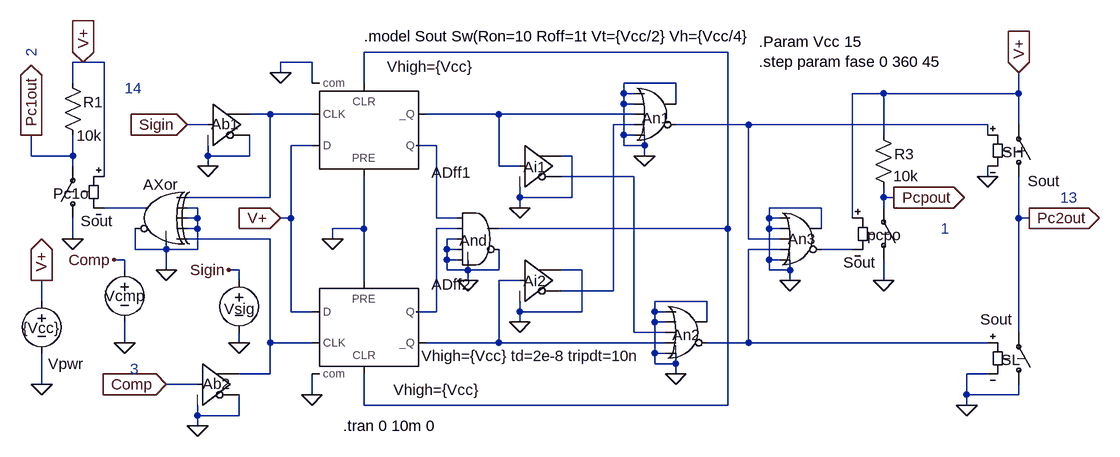
[diagram p0: schematic DF2b.asc]
DF2b.asc, the LTspice schematic file:
Version 4
SHEET 1 1280 856
WIRE -672 240 -672 208
WIRE -656 464 -656 432
WIRE -656 592 -656 544
WIRE -608 128 -608 96
WIRE -608 240 -672 240
WIRE -608 240 -608 208
WIRE -608 256 -608 240
WIRE -608 368 -608 336
WIRE -592 96 -608 96
WIRE -560 96 -592 96
WIRE -560 272 -560 96
WIRE -528 400 -544 400
WIRE -528 416 -528 400
WIRE -528 528 -528 496
WIRE -512 384 -512 352
WIRE -496 320 -560 320
WIRE -464 384 -512 384
WIRE -464 384 -464 368
WIRE -464 416 -464 384
WIRE -416 320 -432 320
WIRE -416 336 -432 336
WIRE -416 336 -416 320
WIRE -416 352 -432 352
WIRE -416 352 -416 336
WIRE -416 384 -464 384
WIRE -416 384 -416 352
WIRE -416 592 -464 592
WIRE -416 640 -416 624
WIRE -416 656 -416 640
WIRE -400 192 -432 192
WIRE -400 240 -400 224
WIRE -400 256 -400 240
WIRE -352 416 -368 416
WIRE -352 432 -352 416
WIRE -352 528 -352 512
WIRE -352 640 -416 640
WIRE -352 640 -352 608
WIRE -336 240 -400 240
WIRE -336 240 -336 208
WIRE -304 176 -336 176
WIRE -304 304 -432 304
WIRE -304 304 -304 176
WIRE -304 368 -432 368
WIRE -304 528 -304 368
WIRE -304 576 -352 576
WIRE -304 576 -304 528
WIRE -288 112 -288 96
WIRE -272 336 -288 336
WIRE -272 336 -272 224
WIRE -272 480 -272 336
WIRE -240 96 -288 96
WIRE -240 128 -240 96
WIRE -240 176 -304 176
WIRE -240 224 -272 224
WIRE -240 480 -272 480
WIRE -240 528 -304 528
WIRE -240 608 -240 576
WIRE -208 368 -208 352
WIRE -160 128 -160 80
WIRE -160 352 -208 352
WIRE -160 352 -160 272
WIRE -160 432 -160 352
WIRE -160 624 -160 576
WIRE -48 224 -80 224
WIRE -48 336 -48 224
WIRE -48 480 -80 480
WIRE -48 480 -48 352
WIRE -32 384 -32 368
WIRE -32 400 -32 384
WIRE -32 416 -32 400
WIRE -16 336 -48 336
WIRE -16 352 -48 352
WIRE -16 368 -32 368
WIRE -16 384 -32 384
WIRE -16 400 -32 400
WIRE 0 416 -32 416
WIRE 0 416 0 400
WIRE 0 432 0 416
WIRE 48 176 -64 176
WIRE 48 256 48 176
WIRE 48 416 0 416
WIRE 48 416 48 384
WIRE 48 528 -64 528
WIRE 48 528 48 432
WIRE 80 256 48 256
WIRE 80 304 80 288
WIRE 80 320 80 304
WIRE 80 432 48 432
WIRE 80 480 80 464
WIRE 80 496 80 480
WIRE 160 240 144 240
WIRE 160 304 80 304
WIRE 160 304 160 240
WIRE 176 416 144 416
WIRE 176 480 80 480
WIRE 176 480 176 416
WIRE 224 448 144 448
WIRE 224 448 224 192
WIRE 240 144 240 128
WIRE 240 160 240 144
WIRE 240 208 240 160
WIRE 240 224 240 208
WIRE 256 144 240 144
WIRE 256 160 240 160
WIRE 256 176 48 176
WIRE 256 192 224 192
WIRE 256 208 240 208
WIRE 256 272 144 272
WIRE 256 512 256 272
WIRE 272 224 240 224
WIRE 272 224 272 208
WIRE 272 240 272 224
WIRE 288 480 288 464
WIRE 288 496 288 480
WIRE 288 544 288 496
WIRE 288 560 288 544
WIRE 304 480 288 480
WIRE 304 496 288 496
WIRE 304 512 256 512
WIRE 304 528 48 528
WIRE 304 544 288 544
WIRE 320 128 240 128
WIRE 320 160 320 128
WIRE 320 560 288 560
WIRE 320 560 320 544
WIRE 320 576 320 560
WIRE 368 464 288 464
WIRE 368 496 368 464
WIRE 400 80 -160 80
WIRE 400 352 48 352
WIRE 400 352 400 80
WIRE 400 624 -160 624
WIRE 400 624 400 352
WIRE 432 192 320 192
WIRE 432 368 432 192
WIRE 432 528 368 528
WIRE 432 528 432 384
WIRE 464 336 464 320
WIRE 464 352 464 336
WIRE 464 400 464 352
WIRE 464 416 464 400
WIRE 480 336 464 336
WIRE 480 352 464 352
WIRE 480 368 432 368
WIRE 480 384 432 384
WIRE 480 400 464 400
WIRE 496 416 464 416
WIRE 496 416 496 400
WIRE 496 432 496 416
WIRE 544 320 464 320
WIRE 544 352 544 320
WIRE 592 336 592 144
WIRE 592 384 544 384
WIRE 640 144 592 144
WIRE 640 208 640 144
WIRE 640 304 640 288
WIRE 640 320 640 304
WIRE 640 432 640 400
WIRE 656 304 640 304
WIRE 768 608 768 576
WIRE 768 624 768 608
WIRE 800 192 432 192
WIRE 800 208 800 192
WIRE 800 272 800 256
WIRE 800 528 432 528
WIRE 800 576 768 576
WIRE 848 144 640 144
WIRE 848 144 848 112
WIRE 848 192 848 144
WIRE 848 336 848 272
WIRE 848 512 848 336
WIRE 848 608 768 608
WIRE 848 608 848 592
WIRE 864 336 848 336
FLAG -656 592 0
FLAG -656 432 V+
IOPIN -656 432 Out
FLAG -288 336 V+
IOPIN -288 336 In
FLAG -432 192 Sigin
IOPIN -432 192 In
FLAG -464 592 Comp
IOPIN -464 592 In
FLAG 656 304 Pcpout
IOPIN 656 304 Out
FLAG 848 112 V+
IOPIN 848 112 In
FLAG 768 624 0
FLAG 864 336 Pc2out
IOPIN 864 336 Out
FLAG -208 368 0
FLAG -672 208 Pc1out
IOPIN -672 208 Out
FLAG -352 528 0
FLAG -528 528 0
FLAG -544 400 Comp
FLAG -368 416 Sigin
FLAG 640 432 0
FLAG -240 608 0
FLAG -288 112 0
FLAG 320 576 0
FLAG 80 320 0
FLAG 80 496 0
FLAG -400 256 0
FLAG -416 656 0
FLAG -464 416 0
FLAG 496 432 0
FLAG 0 432 0
FLAG 272 240 0
FLAG -608 368 0
FLAG -592 96 V+
IOPIN -592 96 In
FLAG 800 272 0
SYMBOL voltage -656 448 R0
WINDOW 3 -29 57 Left 0
WINDOW 123 0 0 Left 0
WINDOW 0 10 112 Left 0
SYMATTR Value {Vcc}
SYMATTR InstName Vpwr
SYMATTR SpiceLine Rser=10 Cpar=1u
SYMBOL voltage -352 416 R0
WINDOW 0 -23 60 Left 0
WINDOW 3 -55 -21 Invisible 0
WINDOW 123 0 0 Left 0
WINDOW 39 0 0 Left 0
SYMATTR InstName Vsig
SYMATTR Value SINE({Vcc/2} {Vcc/2} 1k 0 0 {fase})
SYMBOL voltage -528 400 R0
WINDOW 0 -31 56 Left 0
WINDOW 3 -93 -7 Invisible 0
WINDOW 123 0 0 Left 0
WINDOW 39 0 0 Left 0
SYMATTR InstName Vcmp
SYMATTR Value SINE({Vcc/2} {Vcc/2} 1k 0 0)
SYMBOL Digital\\dflop -160 432 R0
WINDOW 3 46 168 Left 0
SYMATTR InstName ADff2
SYMATTR Value Vhigh={Vcc}
SYMBOL Digital\\dflop -160 272 M180
WINDOW 3 36 169 Left 0
SYMATTR InstName ADff1
SYMATTR Value Vhigh={Vcc}
SYMBOL Digital\\or 288 112 R0
WINDOW 0 -20 70 Left 0
WINDOW 3 -8 128 Invisible 0
SYMATTR InstName An1
SYMATTR Value Vhigh={Vcc}
SYMBOL Digital\\or 336 448 R0
WINDOW 0 -21 68 Left 0
WINDOW 3 -14 92 Invisible 0
SYMATTR InstName An2
SYMATTR Value Vhigh={Vcc}
SYMBOL Digital\\buf 80 192 R0
WINDOW 0 6 65 Left 0
WINDOW 3 8 120 Invisible 0
SYMATTR InstName Ai1
SYMATTR Value Vhigh={Vcc}
SYMBOL Digital\\buf 80 368 R0
WINDOW 0 6 65 Left 0
WINDOW 3 8 120 Invisible 0
SYMATTR InstName Ai2
SYMATTR Value Vhigh={Vcc}
SYMBOL Digital\\buf -400 128 R0
WINDOW 0 5 63 Left 0
WINDOW 3 8 120 Invisible 0
SYMATTR InstName Ab1
SYMATTR Value Vhigh={Vcc} td=1e-7 tripdt=10n
SYMBOL Digital\\buf -416 528 R0
WINDOW 0 8 63 Left 0
WINDOW 3 8 120 Invisible 0
SYMATTR InstName Ab2
SYMATTR Value Vhigh={Vcc} td=1e-7 tripdt=10n
SYMBOL Digital\\xor -480 272 M0
WINDOW 0 -34 12 Left 0
WINDOW 3 16 112 Invisible 0
SYMATTR InstName AXor
SYMATTR Value Vhigh={Vcc}
SYMBOL Digital\\or 512 304 R0
WINDOW 0 -19 64 Left 0
WINDOW 3 -8 128 Invisible 0
SYMATTR InstName An3
SYMATTR Value Vhigh={Vcc}
SYMBOL Digital\\and 16 304 R0
WINDOW 0 -29 66 Left 0
WINDOW 3 -87 244 Left 0
SYMATTR InstName And
SYMATTR Value Vhigh={Vcc} td=2e-8 tripdt=10n
SYMBOL sw 848 288 M180
WINDOW 0 -25 54 Left 0
WINDOW 3 14 9 Left 0
SYMATTR InstName SH
SYMATTR Value Sout
SYMBOL sw 848 608 M180
WINDOW 0 -27 54 Left 0
WINDOW 3 -59 116 Left 0
SYMATTR InstName SL
SYMATTR Value Sout
SYMBOL sw 640 416 M180
WINDOW 0 -25 54 Left 0
WINDOW 3 -62 12 Left 0
SYMATTR InstName pcpo
SYMATTR Value Sout
SYMBOL res 656 304 R180
WINDOW 0 -31 67 Left 0
WINDOW 3 -38 33 Left 0
SYMATTR InstName R3
SYMATTR Value 10k
SYMBOL sw -608 352 R180
WINDOW 0 -25 54 Left 0
WINDOW 3 -62 12 Left 0
SYMATTR InstName Pc1o
SYMATTR Value Sout
SYMBOL res -624 112 R0
WINDOW 0 32 45 Left 0
WINDOW 3 22 97 Left 0
SYMATTR InstName R1
SYMATTR Value 10k
TEXT 448 64 Left 0 !.Param Vcc 15\n.step param fase 0 360 45
TEXT -528 136 Left 0 ;14
TEXT -520 568 Left 0 ;3
TEXT -672 88 VLeft 0 ;2
TEXT 912 304 Left 0 ;13
TEXT 728 352 Left 0 ;1
TEXT -192 656 Left 0 !.tran 0 10m 0
TEXT -160 56 Left 0 !.model Sout Sw(Ron=10 Roff=1t Vt={Vcc/2} Vh={Vcc/4}

The netlist it stands for:
* DF2b.asc
Vpwr V+ 0 {Vcc} Rser=10 Cpar=1u
Vsig Sigin 0 SINE({Vcc/2} {Vcc/2} 1k 0 0 {fase})
Vcmp Comp 0 SINE({Vcc/2} {Vcc/2} 1k 0 0)
ADff2 V+ 0 N003 0 N004 N008 N006 0 DFLOP Vhigh={Vcc}
ADff1 V+ 0 N002 0 N004 N007 N005 0 DFLOP Vhigh={Vcc}
An1 0 0 N007 N009 0 N011 0 0 OR Vhigh={Vcc}
An2 0 0 N010 N008 0 N012 0 0 OR Vhigh={Vcc}
Ai1 N007 0 0 0 0 N010 0 0 BUF Vhigh={Vcc}
Ai2 N008 0 0 0 0 N009 0 0 BUF Vhigh={Vcc}
Ab1 Sigin 0 0 0 0 0 N002 0 BUF Vhigh={Vcc} td=1e-7 tripdt=10n
Ab2 Comp 0 0 0 0 0 N003 0 BUF Vhigh={Vcc} td=1e-7 tripdt=10n
AXor N002 0 0 0 N003 0 N001 0 XOR Vhigh={Vcc}
An3 0 0 N011 N012 0 N013 0 0 OR Vhigh={Vcc}
And N005 N006 0 0 0 0 N004 0 AND Vhigh={Vcc} td=2e-8 tripdt=10n
SH Pc2out V+ N011 0 Sout
SL 0 Pc2out N012 0 Sout
S§pcpo 0 Pcpout V+ N013 Sout
R3 Pcpout V+ 10k
S§Pc1o 0 Pc1out V+ N001 Sout
R1 V+ Pc1out 10k
.Param Vcc 15
.step param fase 0 360 45
* 14
* 3
* 2
* 13
* 1
.tran 0 10m 0
.model Sout Sw(Ron=10 Roff=1t Vt={Vcc/2} Vh={Vcc/4}
.backanno
.end